# EasyEDA schematic SCH_Custom Arduino_2022-07-22.json
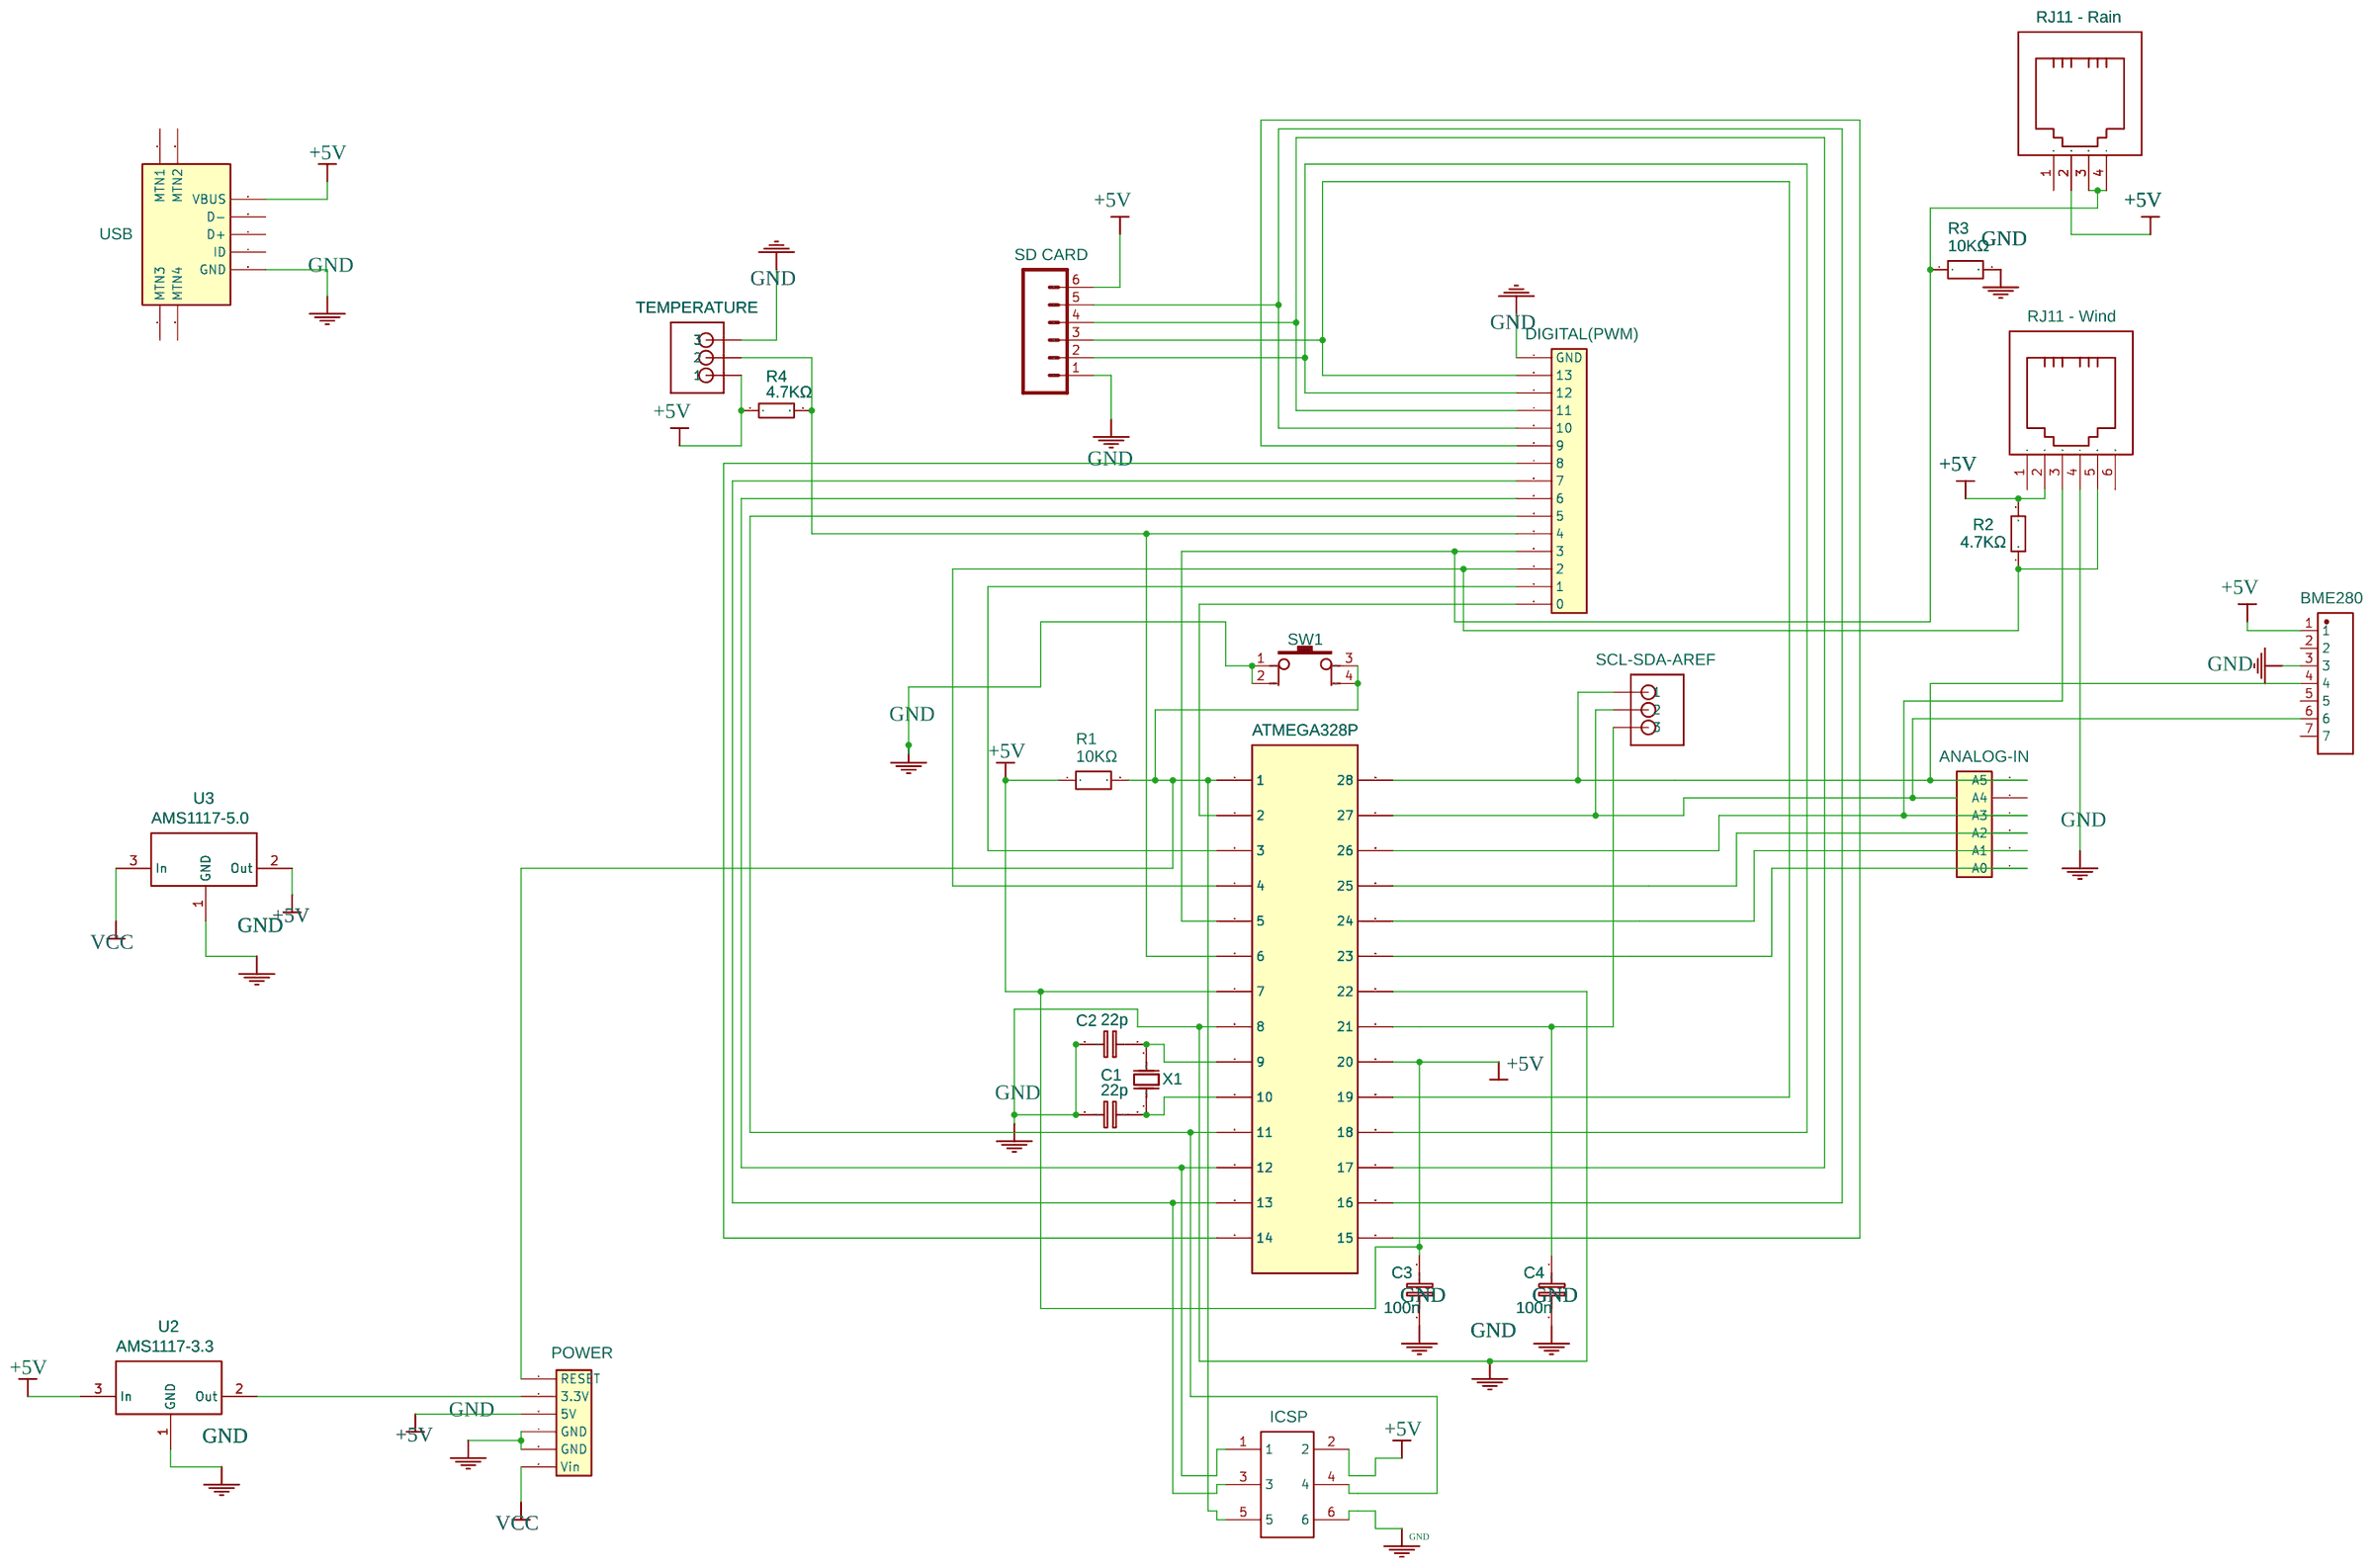
[diagram p0: schematic sheet]

## Parts
ANALOG-IN  Header-Female-2.54_1x6  [HDR-6X1/2.54]
ATMEGA328P  DS1009-28AT1WX-0A2  [DIP 28]
C1  22p  [RAD-0.1]
C2  22p  [RAD-0.1]
C3  100n  [RAD-0.1]
C4  100n  [RAD-0.1]
CN1  BME280  [CONN-TH_7P-P2.54_C9900012194]
DIGITAL(PWM)  Header-Female-2.54_1x15  [HDR-15X1/2.54]
ICSP  ICSP  [2X3 PIN THROUGH HOLE]
POWER  Header-Female-2.54_1x6  [HDR-6X1/2.54]
R1  10KΩ  [10K]
R2  4.7KΩ  [AXIAL-0.4]
R3  10KΩ  [10K]
R4  4.7KΩ  [AXIAL-0.4]
RAIN  RJ11 - Rain  [RJ11-TH_FRJ11006-1100K6K20]
SCL-SDA-AREF  SCL-SDA-AREF  [JST_B3B-PH_HEADER]
SD-CARD  SD CARD  [SCREWTERMINAL-3.5MM-6]
SW1  K2-1187SQ-A4SW  [KEY-5.2*5.2]
TEMPERATURE  TEMPERATURE  [JST_B3B-PH_HEADER]
U2  AMS1117-3.3  [SOT-223]
U3  AMS1117-5.0  [SOT-223]
USB1  USB  [MICRO-USB-1]
WIND  RJ11 - Wind  [RJ11-TH_FRJ11001-1100K6K20]
X1  16MHZ  [OSC-49S-1]

## Library data of the parts
ANALOG-IN POWER = -: Supplier: LCSC; Manufacturer: LCSC; Supplier Part: C40877
ATMEGA328P = -: Supplier: LCSC; Manufacturer: CONNFLY; Mounted: Yes; Supplier Part: C72121; Package Display: No
C1 C2 = Capacitor1_EU: Contributor: EasyEDA; sim: true; Package Display: No
C3 = Capacitor1_EU: Contributor: EasyEDA; Capacitance: 1u; sim: true; Package Display: No
C4 = Capacitor1_EU: Contributor: EasyEDA; Capacitance: 1u; sim: true
CN1 = 1*7PIN排间距2.54MM: Supplier: LCSC; Supplier Part: C9900012194; Manufacturer: null; Manufacturer Part: 1*7pin排间距2.54mm; Contributor: LCSC; JLCPCB Part Class: Extended Part
DIGITAL(PWM) = -: Supplier: LCSC; Manufacturer: ReliaPro; Manufacturer Part: Female header1X15P 2.54mm; Supplier Part: C54104; Package Display: No
ICSP = 2X3 PINHD: Contributor: Alex1987; Package Display: No
R1 R3 = 10k: Supplier Part: C385441; Manufacturer: TyoHM; Manufacturer Part: RN1/2WS10KΩFT/BA1; Contributor: sirineti; JLCPCB Part Class: Extended Part; Resistance: 10kΩ; Package Display: No
R2 R4 = 4.7KΩ: Power: 1/4W; Tolerance: ±1%; Supplier Part: C57204; Supplier: LCSC; Manufacturer: UniOhm; Manufacturer Part: MFR0W4F4701A50; Package Display: No
RAIN = FRJ11006-1100K6K20: Supplier: LCSC; Supplier Part: C456395; Manufacturer: TXGA(特思嘉); Contributor: LCSC; JLCPCB Part Class: Extended Part; Package Display: No
SCL-SDA-AREF TEMPERATURE = JST-PH_3-PIN_HEADER: Package Display: No
SD-CARD = M063.5MM-6: Header 6; Contributor: SparkFun; Package Display: No
SW1 = -: Supplier: LCSC; Manufacturer: HRO; Supplier Part: C92584
U2 = -: sourceId: dwIGgezVh; Supplier: LCSC; Manufacturer: AMS; LCSC Assembly: Yes; Supplier Part: C6186
U3 = -: sourceId: HltLFyQwq; Supplier: LCSC; Manufacturer: AMS; LCSC Assembly: Yes; Supplier Part: C6187
USB1 = MICRO USB 5S B: Supplier Part: C10418; Supplier: LCSC; Manufacturer: LCSC
WIND = FRJ11001-1100K6K20: Supplier: LCSC; Supplier Part: C456393; Manufacturer: TXGA(特思嘉); Contributor: LCSC; JLCPCB Part Class: Extended Part; Package Display: No
X1 = -: Supplier: LCSC; Manufacturer: YXC; Manufacturer Part: X49SD16MSD2SC; Supplier Part: C16212

## Nets
+5V: ATMEGA328P.7 ATMEGA328P.20 C3.1 CN1.1 ICSP.2 POWER.3(5V) R1.1 R2.2 R4.1 RAIN.2 SD-CARD.6 TEMPERATURE.P1(1) U2.3(In) U3.2(Out) USB1.1(VBUS) WIND.2
GND: ATMEGA328P.8 ATMEGA328P.22 C1.1 C2.1 C3.2 C4.2 CN1.3 DIGITAL(PWM).1(GND) ICSP.6 POWER.4(GND) POWER.5(GND) R3.2 SD-CARD.1 SW1.1 SW1.2 TEMPERATURE.P3(3) U2.1(GND) U3.1(GND) USB1.5(GND) WIND.4
VCC: POWER.6(Vin) U3.3(In)
Net-(ANALOG-IN-1): ANALOG-IN.1(A0) ATMEGA328P.23
Net-(ANALOG-IN-2): ANALOG-IN.2(A1) ATMEGA328P.24
Net-(ANALOG-IN-3): ANALOG-IN.3(A2) ATMEGA328P.25
Net-(ANALOG-IN-4): ANALOG-IN.4(A3) ATMEGA328P.26 WIND.3
Net-(ANALOG-IN-6): ANALOG-IN.6(A5) ATMEGA328P.28 CN1.4 SCL-SDA-AREF.P1(1)
Net-(ATMEGA328P-1): ATMEGA328P.1 ICSP.5 POWER.1(RESET) R1.2 SW1.3 SW1.4
Net-(ATMEGA328P-2): ATMEGA328P.2 DIGITAL(PWM).15(0)
Net-(ATMEGA328P-3): ATMEGA328P.3 DIGITAL(PWM).14(1)
Net-(ATMEGA328P-4): ATMEGA328P.4 DIGITAL(PWM).13(2) R2.1 WIND.5
Net-(ATMEGA328P-5): ATMEGA328P.5 DIGITAL(PWM).12(3) R3.1 RAIN.3 RAIN.4
Net-(ATMEGA328P-6): ATMEGA328P.6 DIGITAL(PWM).11(4) R4.2 TEMPERATURE.P2(2)
Net-(ATMEGA328P-9): ATMEGA328P.9 C2.2 X1.2(OSC2)
Net-(ATMEGA328P-10): ATMEGA328P.10 C1.2 X1.1(OSC1)
Net-(ATMEGA328P-11): ATMEGA328P.11 DIGITAL(PWM).10(5) ICSP.4
Net-(ATMEGA328P-12): ATMEGA328P.12 DIGITAL(PWM).9(6) ICSP.1
Net-(ATMEGA328P-13): ATMEGA328P.13 DIGITAL(PWM).8(7) ICSP.3
Net-(ATMEGA328P-14): ATMEGA328P.14 DIGITAL(PWM).7(8)
Net-(ATMEGA328P-15): ATMEGA328P.15 DIGITAL(PWM).6(9)
Net-(ATMEGA328P-16): ATMEGA328P.16 DIGITAL(PWM).5(10) SD-CARD.5
Net-(ATMEGA328P-17): ATMEGA328P.17 DIGITAL(PWM).4(11) SD-CARD.4
Net-(ATMEGA328P-18): ATMEGA328P.18 DIGITAL(PWM).3(12) SD-CARD.2
Net-(ATMEGA328P-19): ATMEGA328P.19 DIGITAL(PWM).2(13) SD-CARD.3
Net-(ATMEGA328P-21): ATMEGA328P.21 C4.1 SCL-SDA-AREF.P3(3)
Net-(ATMEGA328P-27): ATMEGA328P.27 CN1.6 SCL-SDA-AREF.P2(2)
Net-(POWER-2): POWER.2(3.3V) U2.2(Out)

Not connected (* = marked no-connect by the designer): ANALOG-IN 5(A4); CN1 2 5 7; RAIN 1; USB1 0(MTN1) 2(D-) 3(D+) 4(ID); WIND 1 6
